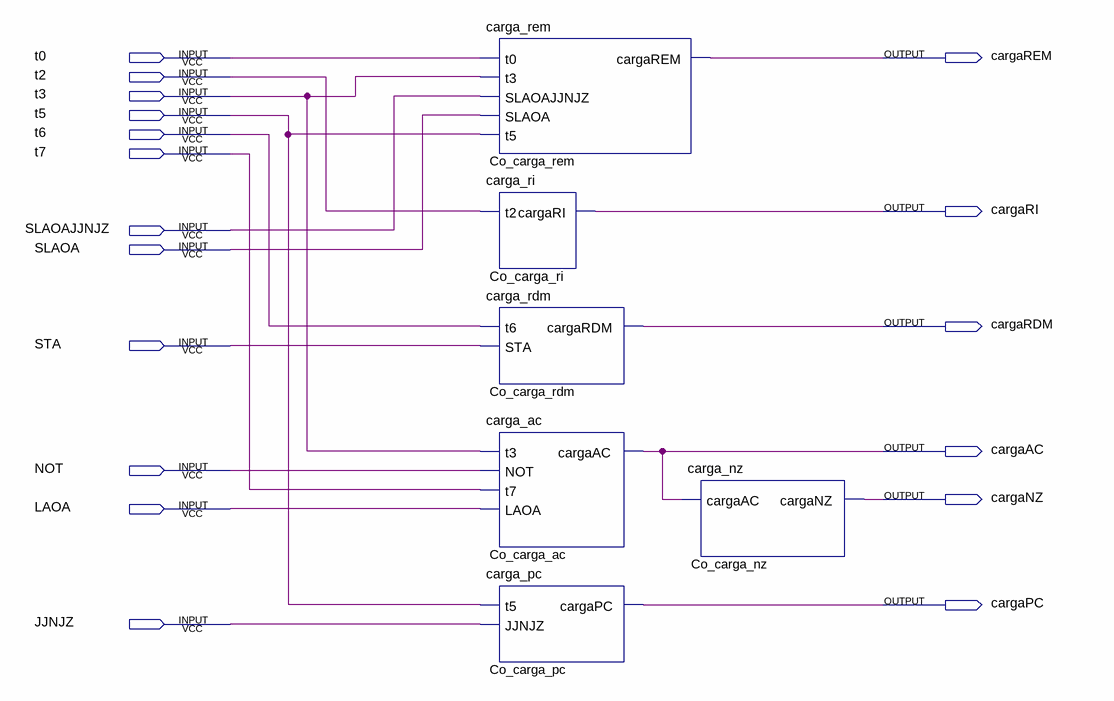
[diagram p0: schematic sheet]
// Quartus schematic carga.bdf as structural Verilog: 6 symbols, 18 pins
module carga (
  input  t0,
  input  t2,
  input  t3,
  input  t5,
  input  t6,
  input  t7,
  input  SLAOAJJNJZ,
  input  SLAOA,
  input  STA,
  input  NOT,
  input  LAOA,
  input  JJNJZ,
  output cargaREM,
  output cargaRI,
  output cargaRDM,
  output cargaAC,
  output cargaNZ,
  output cargaPC
);

  carga_rem Co_carga_rem (.t0(t0), .t3(t3), .SLAOAJJNJZ(SLAOAJJNJZ), .SLAOA(SLAOA), .t5(t5), .cargaREM(cargaREM));
  carga_ri Co_carga_ri (.t2(t2), .cargaRI(cargaRI));
  carga_rdm Co_carga_rdm (.t6(t6), .STA(STA), .cargaRDM(cargaRDM));
  carga_ac Co_carga_ac (.t3(t3), .NOT(NOT), .t7(t7), .LAOA(LAOA), .cargaAC(cargaAC));
  carga_pc Co_carga_pc (.t5(t5), .JJNJZ(JJNJZ), .cargaPC(cargaPC));
  carga_nz Co_carga_nz (.cargaAC(cargaAC), .cargaNZ(cargaNZ));
endmodule
